# Altium schematic sheet Comms.SchDoc
size A4; SheetNumber: 5; SheetTotal: 7; SPICEModelCacheWWCEIBKB: <root> / <DocumentId>WWCEIBKB</DocumentId> / <CacheFrame Number="0"> / <Model Name="0603_885012106012_4.7uf" Kind="CKT"> / <Text>******* / .subckt 0603_885012106012_4.7uF 1 2 / Rser 1 3 0.00455496693599 / Lser 2 4 5.03384516E-10 / C1 3 4 0.0000047 / Rpar 3 4 20000000 / .ends 0603_885012106012_4.7uF</Text> / </Model> / <Model Name="0603_885012206071_100nf" Kind="CKT"> / <Text>******* / .subckt 0603_885012206071_100nF 1 2 / Rser 1 3 0.025 / Lser 2 4 0.0000000008 / C1 3 4 0.0000001 / Rpar 3 4 5000000000 / .ends 0603_885012206071_100nF</Text> / </Model> / </CacheFrame> / </root>
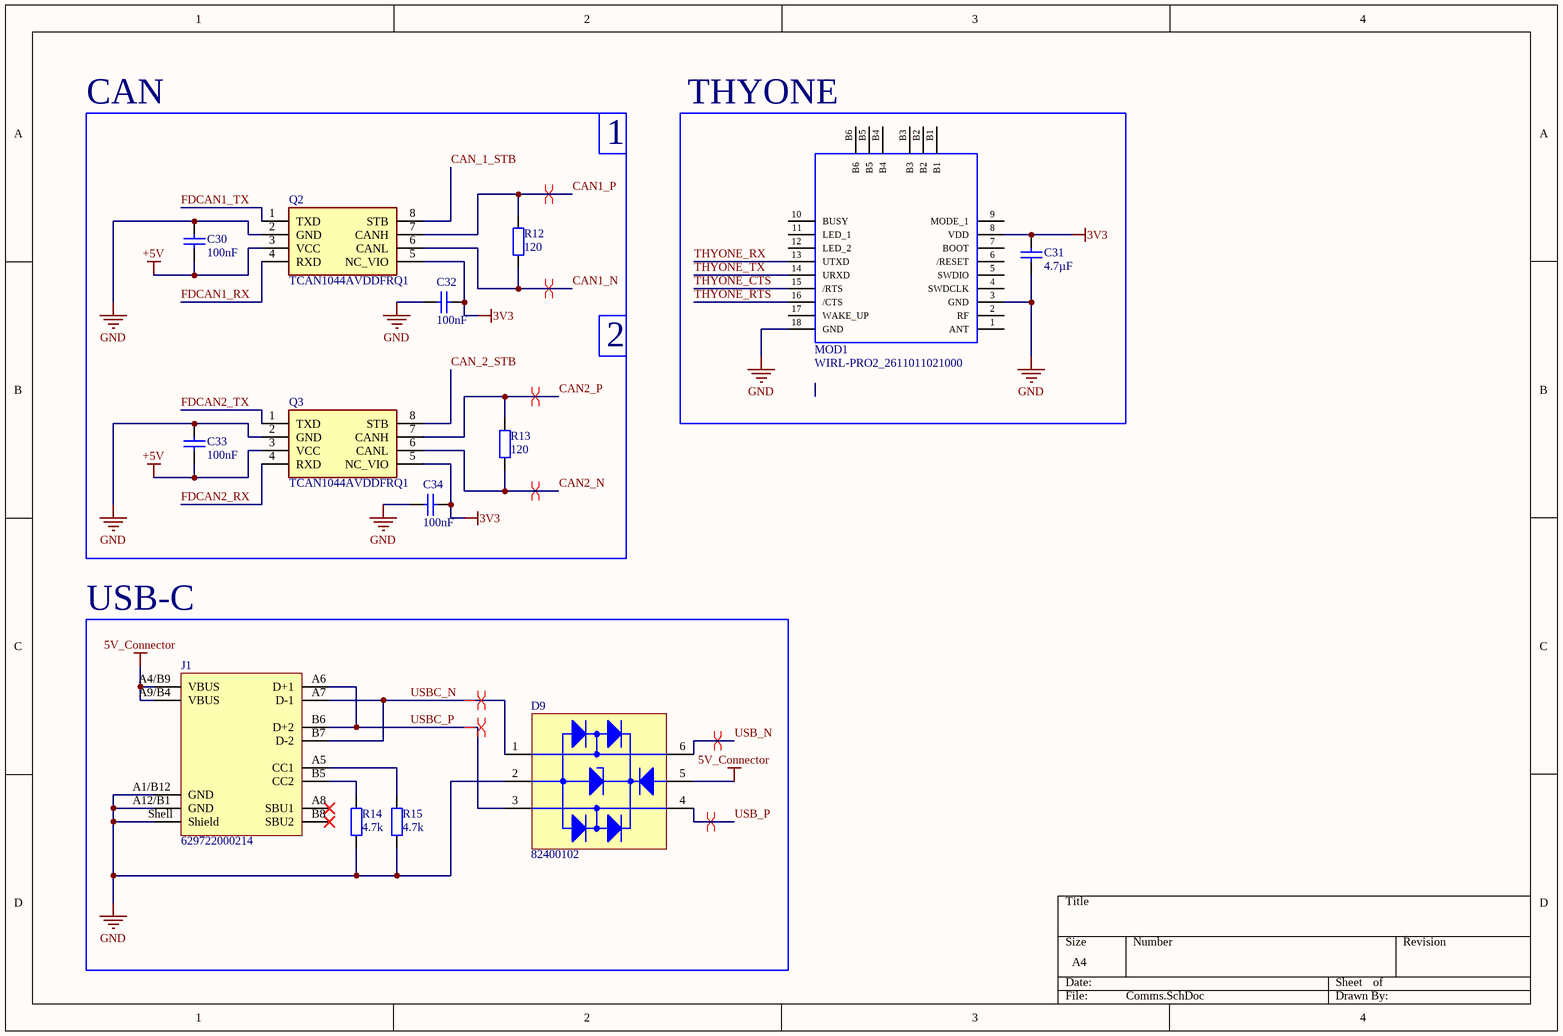
[diagram p0: Comms.SchDoc]

## Parts
C30  value 100nF  [WCAP-CSGP_0603_L1.6W0.8H0.8_Reflow]  (hidden comment: 885012206071)
C31  value 4.7µF  [WCAP-CSGP_0603_L1.6W0.8H0.8_Reflow]  (hidden comment: 885012106012)
C32  value 100nF  [WCAP-CSGP_0603_L1.6W0.8H0.8_Reflow]  (hidden comment: 885012206071)
C33  value 100nF  [WCAP-CSGP_0603_L1.6W0.8H0.8_Reflow]  (hidden comment: 885012206071)
C34  value 100nF  [WCAP-CSGP_0603_L1.6W0.8H0.8_Reflow]  (hidden comment: 885012206071)
D9  82400102  [WE-TVS_SOT23-6L]
J1  629722000214  [629722000214]
MOD1  WIRL-PRO2_2611011021000  [WE-FP-4+]
Q2  TCAN1044AVDDFRQ1  [FP-DDF0008A-MFG]
Q3  TCAN1044AVDDFRQ1  [FP-DDF0008A-MFG]
R12  value 120  [RCS0805120RFKEA-Footprint-1]  (hidden comment: RCS0805120RFKEA)
R13  value 120  [RCS0805120RFKEA-Footprint-1]  (hidden comment: RCS0805120RFKEA)
R14  value 4.7k  [WRIS-RSKS_0603_Reflow]  (hidden comment: 560112116006)
R15  value 4.7k  [WRIS-RSKS_0603_Reflow]  (hidden comment: 560112116006)

## Blocks framed on the sheet
THYONE: C31 MOD1
USB-C: D9 J1 R14 R15

## Nets
3V3: C31.1 C32.1 C34.1 MOD1.8(VDD) Q2.5(NC_VIO) Q3.5(NC_VIO)
5V_Connector: D9.5(VDD) J1.A4/B9(VBUS) J1.A9/B4(VBUS)
+5V: C30.1 C33.1 Q2.3(VCC) Q3.3(VCC)
GND: C30.2 C31.2 C32.2 C33.2 C34.2 D9.2(GND) J1.A1/B12(GND) J1.A12/B1(GND) J1.Shell(Shield) MOD1.3(GND) MOD1.18(GND) Q2.2(GND) Q3.2(GND) R14.2 R15.2
CAN1_N: Q2.6(CANL) R12.1
CAN1_P: Q2.7(CANH) R12.2
CAN2_N: Q3.6(CANL) R13.1
CAN2_P: Q3.7(CANH) R13.2
CAN_1_STB: Q2.8(STB)
CAN_2_STB: Q3.8(STB)
FDCAN1_RX: Q2.4(RXD)
FDCAN1_TX: Q2.1(TXD)
FDCAN2_RX: Q3.4(RXD)
FDCAN2_TX: Q3.1(TXD)
THYONE_CTS: MOD1.15(/RTS)
THYONE_RTS: MOD1.16(/CTS)
THYONE_RX: MOD1.13(UTXD)
THYONE_TX: MOD1.14(URXD)
USB_N: D9.6(I/O_1)
USB_P: D9.4(I/O_2)
USBC_N: D9.1(I/O_1) J1.A7(D-1) J1.B7(D-2)
USBC_P: D9.3(I/O_2) J1.A6(D+1) J1.B6(D+2)
NetJ1_A5: J1.A5(CC1) R15.1
NetJ1_B5: J1.B5(CC2) R14.1

Not connected (* = marked no-connect by the designer): J1 A8(SBU1)* B8(SBU2)*; MOD1 1(ANT) 2(RF) 4(SWDCLK) 5(SWDIO) 6(/RESET) 7(BOOT) 9(MODE_1) 10(BUSY) 11(LED_1) 12(LED_2) 17(WAKE_UP) B1 B2 B3 B4 B5 B6

## Layout directives
differential pair: CAN1_N, CAN1_P, CAN2_N, CAN2_P, USB_N, USB_P, USBC_N, USBC_P

## Notes on the sheet
- CAN
- 1
- 2

## Library data of the parts
C30 C32-C34 = CMP-001-00661-1: WCAP-CSGP Multilayer Ceramic Chip Capacitor, General Purpose, size 0603, X7R, 100nF, 25VDC; Manufacturer: Wurth Elektronik; Dissipation Factor: 3.5%; Capacitance Tolerance: +/-10%; Insulation Resistance: 5GOhm; Technical Reference: X7R0603104K025DFCT10000; Rated Voltage (DC): 25V; Packaging: Tape and Reel; Height: 0.8mm; Mount: Surface Mount; Source: WCAP-CSGP.SchLib; Component Type: Standard; Category: Multilayer Ceramic Chip Capacitors; Operating Temperature Min: -55°C; Case/Package: 0603; ComponentLink2Description: Datasheet Link; Width: 0.8mm; ComponentLink1URL: https://www.we-online.com/redexpert/article/885012206071?ad; Length: 1.6mm; Operating Temperature Max: 125°C; Match Code: WCAP-CSGP; ComponentLink2URL: https://www.we-online.com/redexpert/spec/885012206071?ad; Design Item ID: 885012206071; ComponentLink1Description: Website Link; Manufacturer Part Number: 885012206071; Pins: 2; Ceramic Type: X7R
C31 = CMP-001-00440-1: WCAP-CSGP Multilayer Ceramic Chip Capacitor, General Purpose, size 0603, X5R, 4.7uF, 10VDC; Manufacturer: Wurth Elektronik; Rated Voltage (DC): 10V; Technical Reference: X5R0603475M010DFCT10000; Dissipation Factor: 10%; Insulation Resistance: 0.02GOhm; Capacitance Tolerance: +/-20%; ComponentLink2URL: https://www.we-online.com/redexpert/spec/885012106012?ad; Height: 0.8mm; Packaging: Tape and Reel; Case/Package: 0603; Manufacturer Part Number: 885012106012; Component Type: Standard; Width: 0.8mm; Match Code: WCAP-CSGP; Mount: Surface Mount; Ceramic Type: X5R; Operating Temperature Max: 85°C; ComponentLink1Description: Website Link; Length: 1.6mm; ComponentLink1URL: https://www.we-online.com/redexpert/article/885012106012?ad; ComponentLink2Description: Datasheet Link; Category: Multilayer Ceramic Chip Capacitors; Source: WCAP-CSGP.SchLib; Operating Temperature Min: -55°C; Pins: 2; Design Item ID: 885012106012
D9 = CMP-004-00017-1: WE-TVS TVS Diode – High Speed Series, SOT23-6L, 2+1 Channel, 5V, 2pF; Manufacturer: Wurth Elektronik; Polarity: Unidirectional; Channel ESD Clamping Voltage: 10V; ESD Air Discharge Capability: 15kV; (Reverse) Peak Pulse Current: 7A; (Reverse) Breakdown Voltage: 6V; Channel Reverse Leakage Current: 1uA; ESD Contact Discharge Capability: 8kV; Source: WE-TVS.SchLib; Component Type: Standard; Packaging: Tape and Reel; Height: 1.45mm; Pins: 6; Match Code: WE-TVS; Case/Package: SOT23-6L; Mount: Surface Mount; Channel Operating Voltage: 5V; ComponentLink1Description: Website Link; ComponentLink2URL: https://www.we-online.com/redexpert/spec/82400102?ad; Category: ESD Protection; Channel Input Capacitance: 2pF; Operating Temperature Min: -40°C; ComponentLink1URL: https://www.we-online.com/redexpert/article/82400102?ad; Length: 2.9mm; Width: 2.8mm; Manufacturer Part Number: 82400102; Design Item ID: 82400102; ComponentLink2Description: Datasheet Link; Operating Temperature Max: 125°C; Number of Channels: 2+1
J1 = CMP-133-000027-1: WR-COM USB 2.0 Type C Receptacle Horizontal SMT; Manufacturer: Wurth Elektronik; Interface Type: Type C; Rated Current: 5A; Working Voltage: 20V (DC); Match Code: WR-USB; Number of Ports: 1; Orientation: Horizontal; Application: USB 2.0; ComponentLink1Description: Website Link; Gender: Receptacle; Operating Temperature Min: -40°C; Category: Input/Output Connectors; Pin Count: 13; Packaging: Tape and Reel; Operating Temperature Max: 85°C; ComponentLink1URL: https://www.we-online.com/redexpert/article/629722000214?ad; Component Type: Standard; ComponentLink2URL: https://www.we-online.com/redexpert/spec/629722000214?ad; Design Item ID: 629722000214; Number of Pins: 16; Source: WR-USB.SchLib; Manufacturer Part Number: 629722000214; Mount: Surface Mount; ComponentLink2Description: Datasheet Link
MOD1 = CMP-169-000025-1: Thyone-I - Radio Modules 2.4 GHz; Operating Supply Voltage max.: 3.6V; Operating Supply Voltage min.: 1.8V; Frequency: 2402-2480MHz; RX sensitivity e.r.p.: –; RF Bitrate max.: 2000kbps; Line of Sight Range: 750m; Source: WE_WIRL_Rev15.SchLib; Published Date: April 2019; Operating Temperature: -40 to +85 degC; Publisher: Wurth Elektronik; Design Item ID: WIRL-PRO2_2611011021000; ComponentLink1URL: http://www.we-online.de; ComponentLink2Description: Datasheet; ComponentLink1Description: Manufacturer; Packaging: Tape and Reel; Mounting Technology: SMT; Part Number: 2611011021000; ComponentLink2URL: https://katalog.we-online.de/wco/datasheet/2611011021000.pdf; Output Power e.r.p.: –
Q2 Q3 = CMP-015-00003-4: Enhanced automotive CAN transceiver with standby 8-SOT-23-THIN -40 to 150
R12 R13 = CMP-009-00119-3: Fixed Resistor, Metal Glaze/thick Film, 0.4W, 120ohm, 150V, 1% +/-Tol, 100ppm/Cel, Surface Mount, 0805; Power: 500mW; Case/Package: 0805; Mounting Technology: SMD; Pins: 2
R14 R15 = CMP-009-00329-1: WRIS-RSKS Thick Film Resistor, size 0603, 4700Ohm, 100mW; Manufacturer: Wurth Elektronik; Temperature Coefficient of Resistance Max: 100ppm/°C; Limiting Element Voltage: 75V; Temperature Coefficient of Resistance Min: -100ppm/°C; Resistance Tolerance: +/-1%; Height: 0.45mm; Category: Thick Film Resistors; Operating Temperature Min: -55°C; ComponentLink2URL: https://www.we-online.com/redexpert/spec/560112116006?ad; Mount: Surface Mount; ComponentLink1URL: https://www.we-online.com/redexpert/article/560112116006?ad; Packaging: Tape and Reel; Width: 0.8mm; Pins: 2; Component Type: Standard; Length: 1.6mm; ComponentLink2Description: Datasheet Link; Manufacturer Part Number: 560112116006; Source: WRIS-RSKS.SchLib; ComponentLink1Description: Website Link; Rated Power: 100mW; Match Code: WRIS-RSKS; Design Item ID: 560112116006; Operating Temperature Max: 155°C; Case/Package: 0603